# Altium schematic sheet Main.SchDoc
size A4; Author: Wojciech Gredel; CompanyName: AGH UST; Revision: 1; ProjectName: My_project1
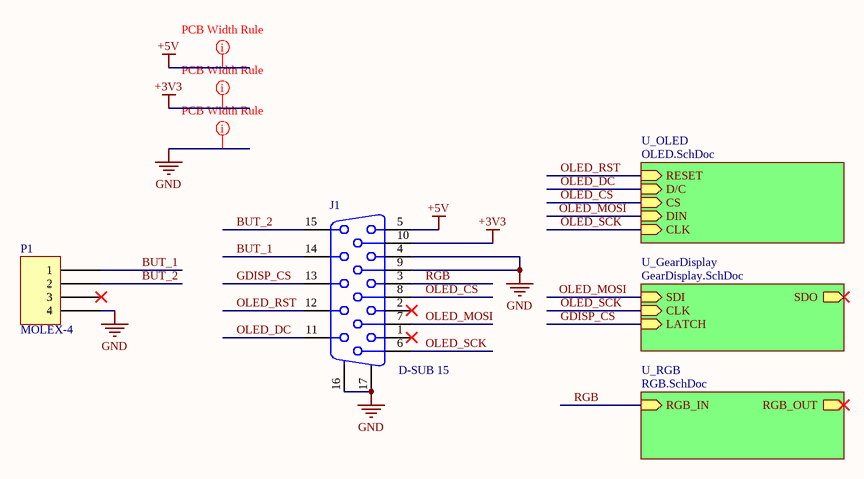
[diagram p0: Main.SchDoc]

## Parts
J1  D-SUB 15  [Dsub-3H15]
P1  MOLEX-4  [MOLEX_4_PIN]

## Sub-sheets
U_GearDisplay = GearDisplay.SchDoc: SDI (in), CLK (in), LATCH (in), SDO (out)
U_OLED = OLED.SchDoc: RESET (in), D/C (in), CS (in), DIN (in), CLK (in)
U_RGB = RGB.SchDoc: RGB_OUT (out), RGB_IN (in)

## Nets
+3V3: J1.10
+5V: J1.5
GND: J1.4 J1.9 J1.16(MH1) J1.17(MH2) P1.4
BUT_1: J1.14 P1.1
BUT_2: J1.15 P1.2
GDISP_CS: J1.13 ; sheet U_GearDisplay/LATCH
OLED_CS: J1.8 ; sheet U_OLED/CS
OLED_DC: J1.11 ; sheet U_OLED/D/C
OLED_MOSI: J1.7 ; sheet U_OLED/DIN, sheet U_GearDisplay/SDI
OLED_RST: J1.12 ; sheet U_OLED/RESET
OLED_SCK: J1.6 ; sheet U_OLED/CLK, sheet U_GearDisplay/CLK
RGB: J1.3 ; sheet U_RGB/RGB_IN

Not connected (* = marked no-connect by the designer): J1 1* 2*; P1 3*

## Layout directives
rule Width Constraint [Pref Width = 25mil    Min Width = 20mil    Max Width = 30mil]: +3V3, +5V
rule Width Constraint [Pref Width = 25mil    Min Width = 10mil    Max Width = 30mil]: GND

## Notes on the sheet
- Confidential / Not for distribution !
- Project name:
- Document name:
- Designer Name:
- Date/Time:
- Revision:

## Library data of the parts
J1 = D-SUB 15: Receptacle Assembly, 15-Pin, Sim Line Connector; Manufacturer: TE Connectivity; PackageDocument: B; Positions: 15; Gender: Receptacle Header; Published: 15-Jun-2001; LatestRevisionDate: 17-Jul-2002; LatestRevisionNote: Re-released for DXP Platform.; DatasheetDocument: 24-Nov-1999; PackageReference: 788574; Publisher: Altium Limited; Orientation: Right Angle; Supplier: TME; Supplier Part Number: 1-1734530-3
P1 = MOLEX-4: 4 pin socket; Manufacturer: Molex; Supplier: TME; Supplier Part Number: MX-43045-0400